# EasyEDA schematic 1-Schematic_plaidcomp_prototype.json
TITLE: Plaid Companion; REV: 1.0; Date: 2020-10-19; Sheet: 1/1; Drawn By: chief_teep; Company: Your Company
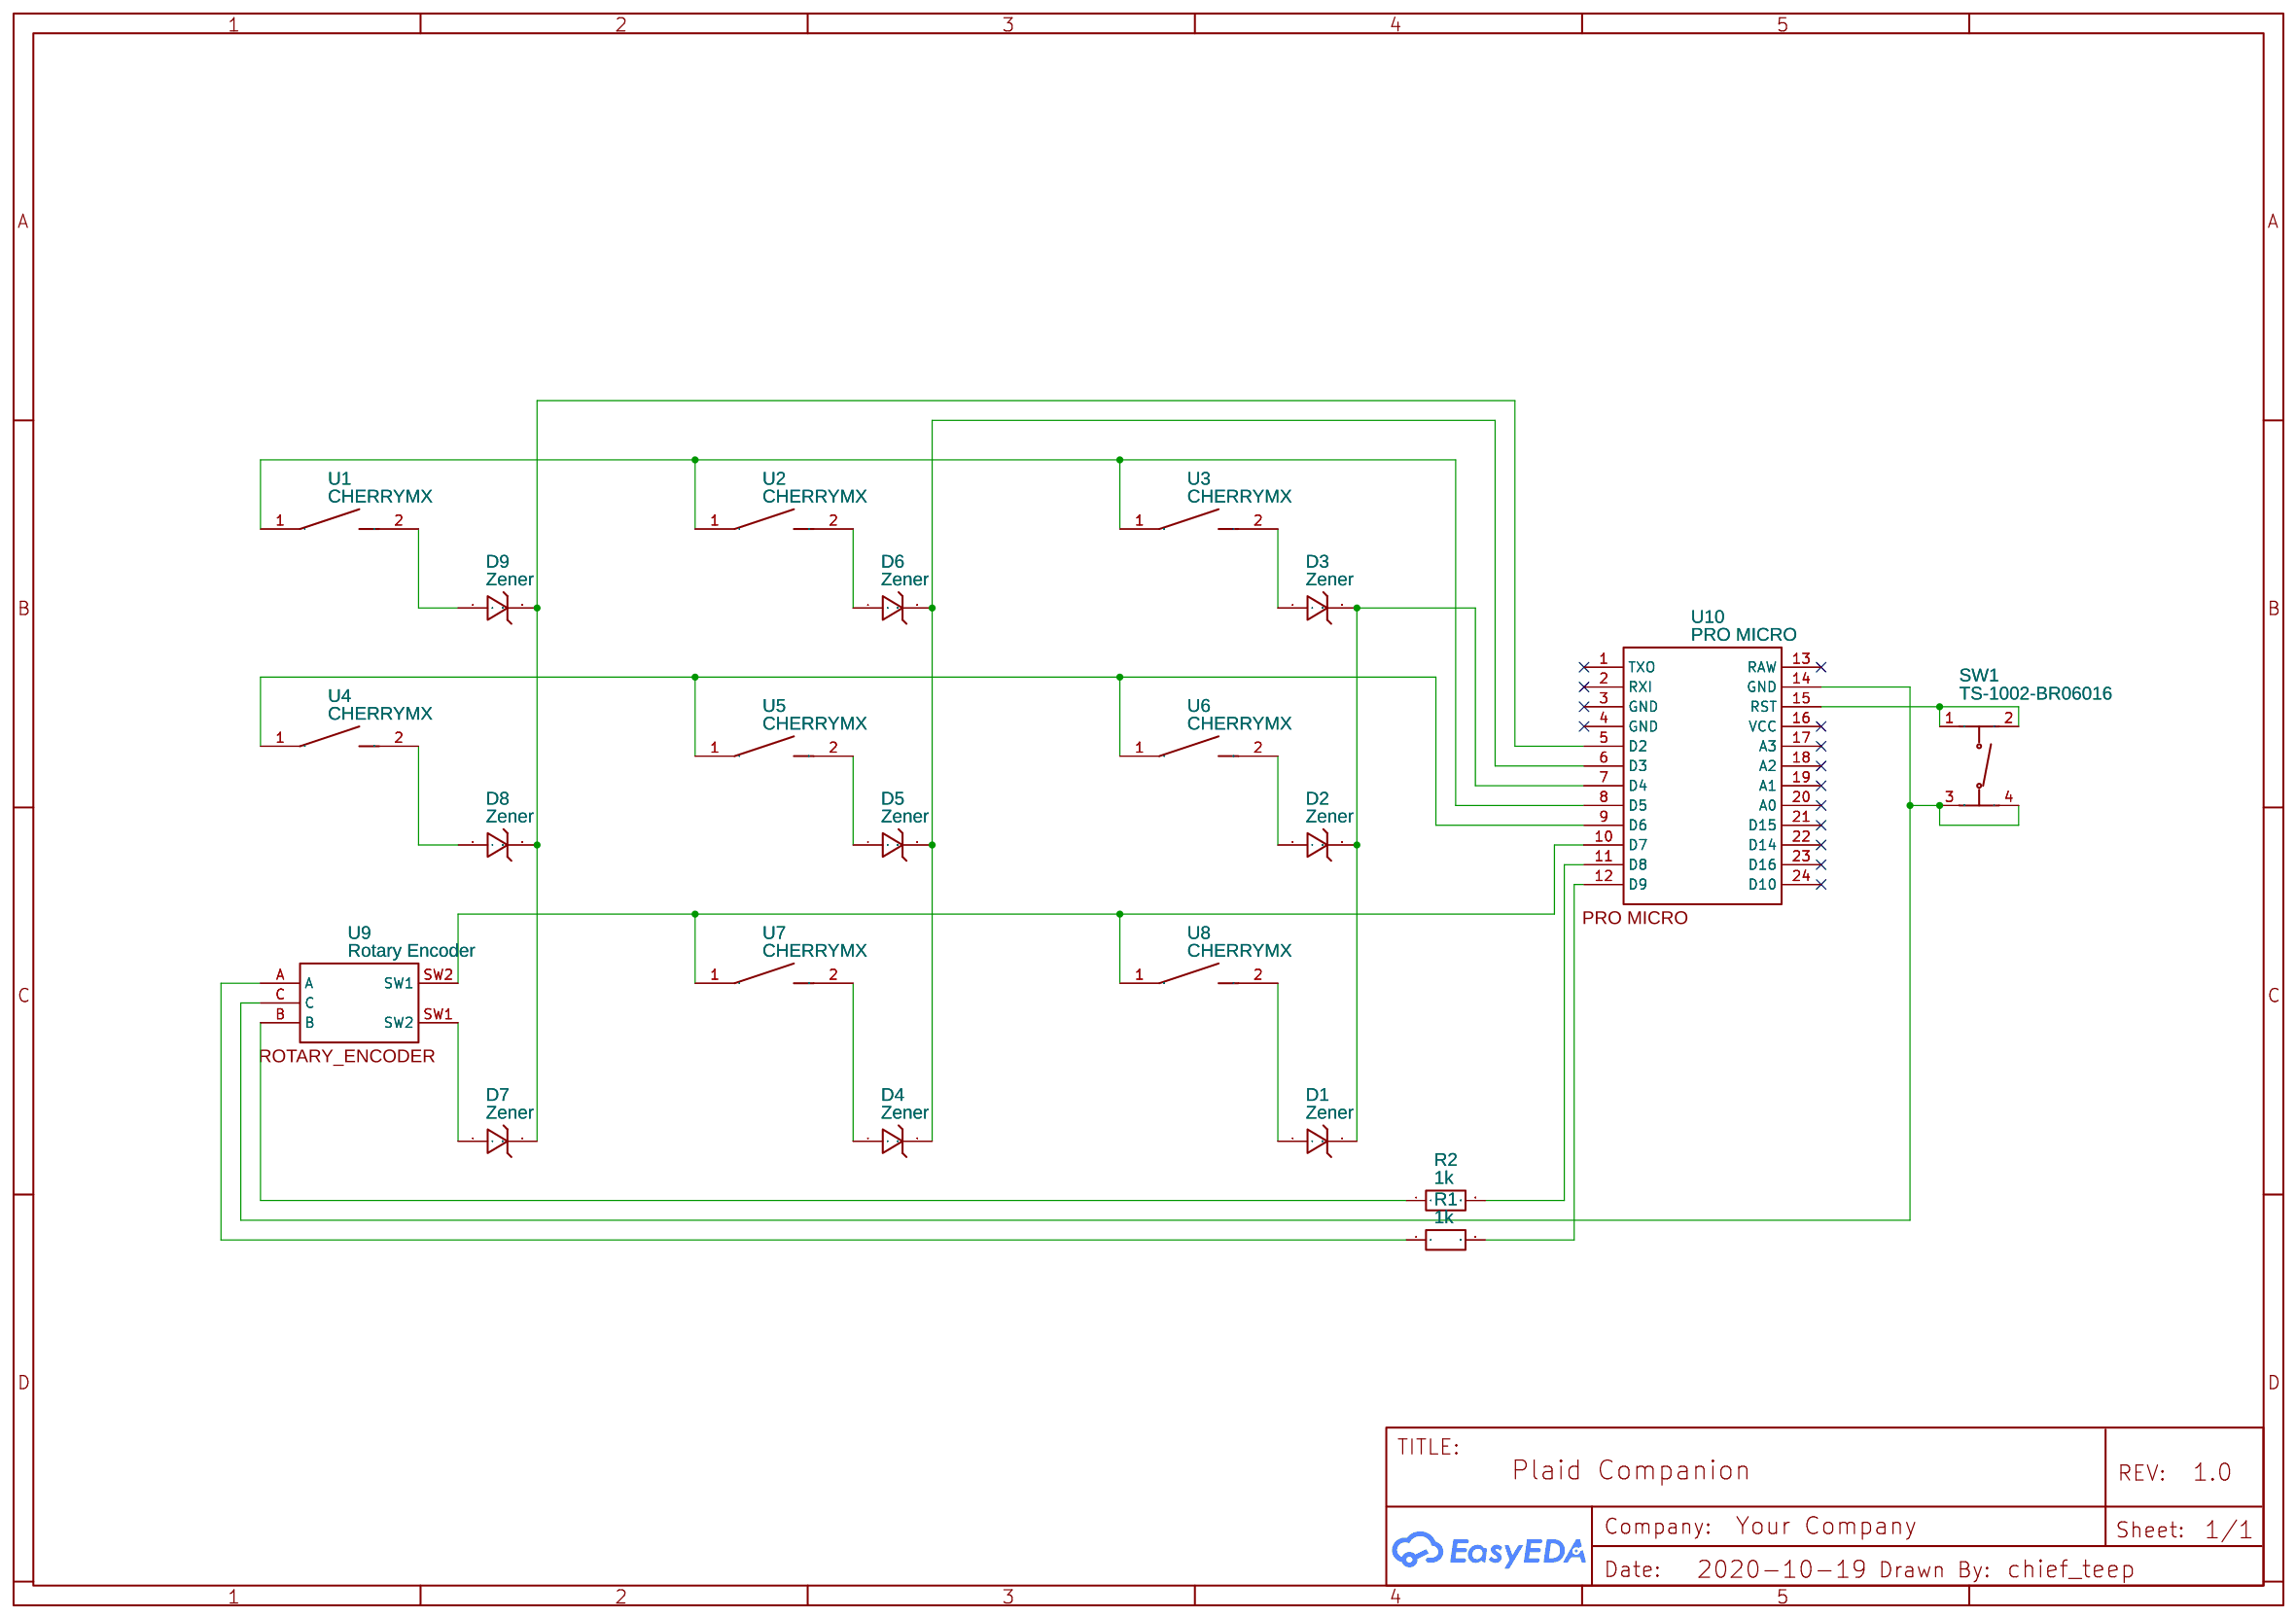
[diagram p0: schematic sheet]

## Parts
D1  Zener  [ZENER]
D2  Zener  [ZENER]
D3  Zener  [ZENER]
D4  Zener  [ZENER]
D5  Zener  [ZENER]
D6  Zener  [ZENER]
D7  Zener  [ZENER]
D8  Zener  [ZENER]
D9  Zener  [ZENER]
R1  1k  [R_AXIAL-0.3]
R2  1k  [R_AXIAL-0.3]
SW1  TS-1002-BR06016  [SW-TH_4P-L6.0-W6.0-P4.50-LS6.5]
U1  CHERRYMX  [CHERRY MX]
U2  CHERRYMX  [CHERRY MX]
U3  CHERRYMX  [CHERRY MX]
U4  CHERRYMX  [CHERRY MX]
U5  CHERRYMX  [CHERRY MX]
U6  CHERRYMX  [CHERRY MX]
U7  CHERRYMX  [CHERRY MX]
U8  CHERRYMX  [CHERRY MX]
U9  Rotary Encoder  [ROTARY_ENCODER]
U10  PRO MICRO  [PRO MICRO]

## Library data of the parts
D1-D9 = Zener: Contributor: cpu76239
R1 R2 = R_AXIAL-0.3_EU: Contributor: LCEDA_Lib
SW1 = TS-1002-BR06016: Supplier: LCSC; Supplier Part: C720295; Manufacturer: XUNPU; Contributor: LCSC
U1-U8 = CHERRYMX: Manufacturer Part: CHERRY; Contributor: drummdan; Supplier: Reichelt
U9 = Rotary Encoder: Contributor: Victor Condino; Package Display: Yes
U10 = PRO MICRO: Contributor: red-hara; Package Display: Yes

## Nets
Net-(D1-1): D1.1 U8.2
Net-(D1-2): D1.2 D2.2 D3.2 U10.7(D4)
Net-(D2-1): D2.1 U6.2
Net-(D3-1): D3.1 U3.2
Net-(D4-1): D4.1 U7.2
Net-(D4-2): D4.2 D5.2 D6.2 U10.6(D3)
Net-(D5-1): D5.1 U5.2
Net-(D6-1): D6.1 U2.2
Net-(D7-1): D7.1 U9.SW1(SW2)
Net-(D7-2): D7.2 D8.2 D9.2 U10.5(D2)
Net-(D8-1): D8.1 U4.2
Net-(D9-1): D9.1 U1.2
Net-(R1-1): R1.1 U9.A
Net-(R1-2): R1.2 U10.12(D9)
Net-(R2-1): R2.1 U9.B
Net-(R2-2): R2.2 U10.11(D8)
Net-(SW1-1): SW1.1 SW1.2 U10.15(RST)
Net-(SW1-3): SW1.3 SW1.4 U9.C U10.14(GND)
Net-(U1-1): U1.1 U2.1 U3.1 U10.8(D5)
Net-(U4-1): U4.1 U5.1 U6.1 U10.9(D6)
Net-(U7-1): U7.1 U8.1 U9.SW2(SW1) U10.10(D7)

Not connected (* = marked no-connect by the designer): U10 1(TXO)* 2(RXI)* 3(GND)* 4(GND)* 13(RAW)* 16(VCC)* 17(A3)* 18(A2)* 19(A1)* 20(A0)* 21(D15)* 22(D14)* 23(D16)* 24(D10)*
